# EAGLE design FT311_breakout.v1b (EAGLE 5.07)
LICENSE: CC-0; PROJECT: FT311 breakout v1b
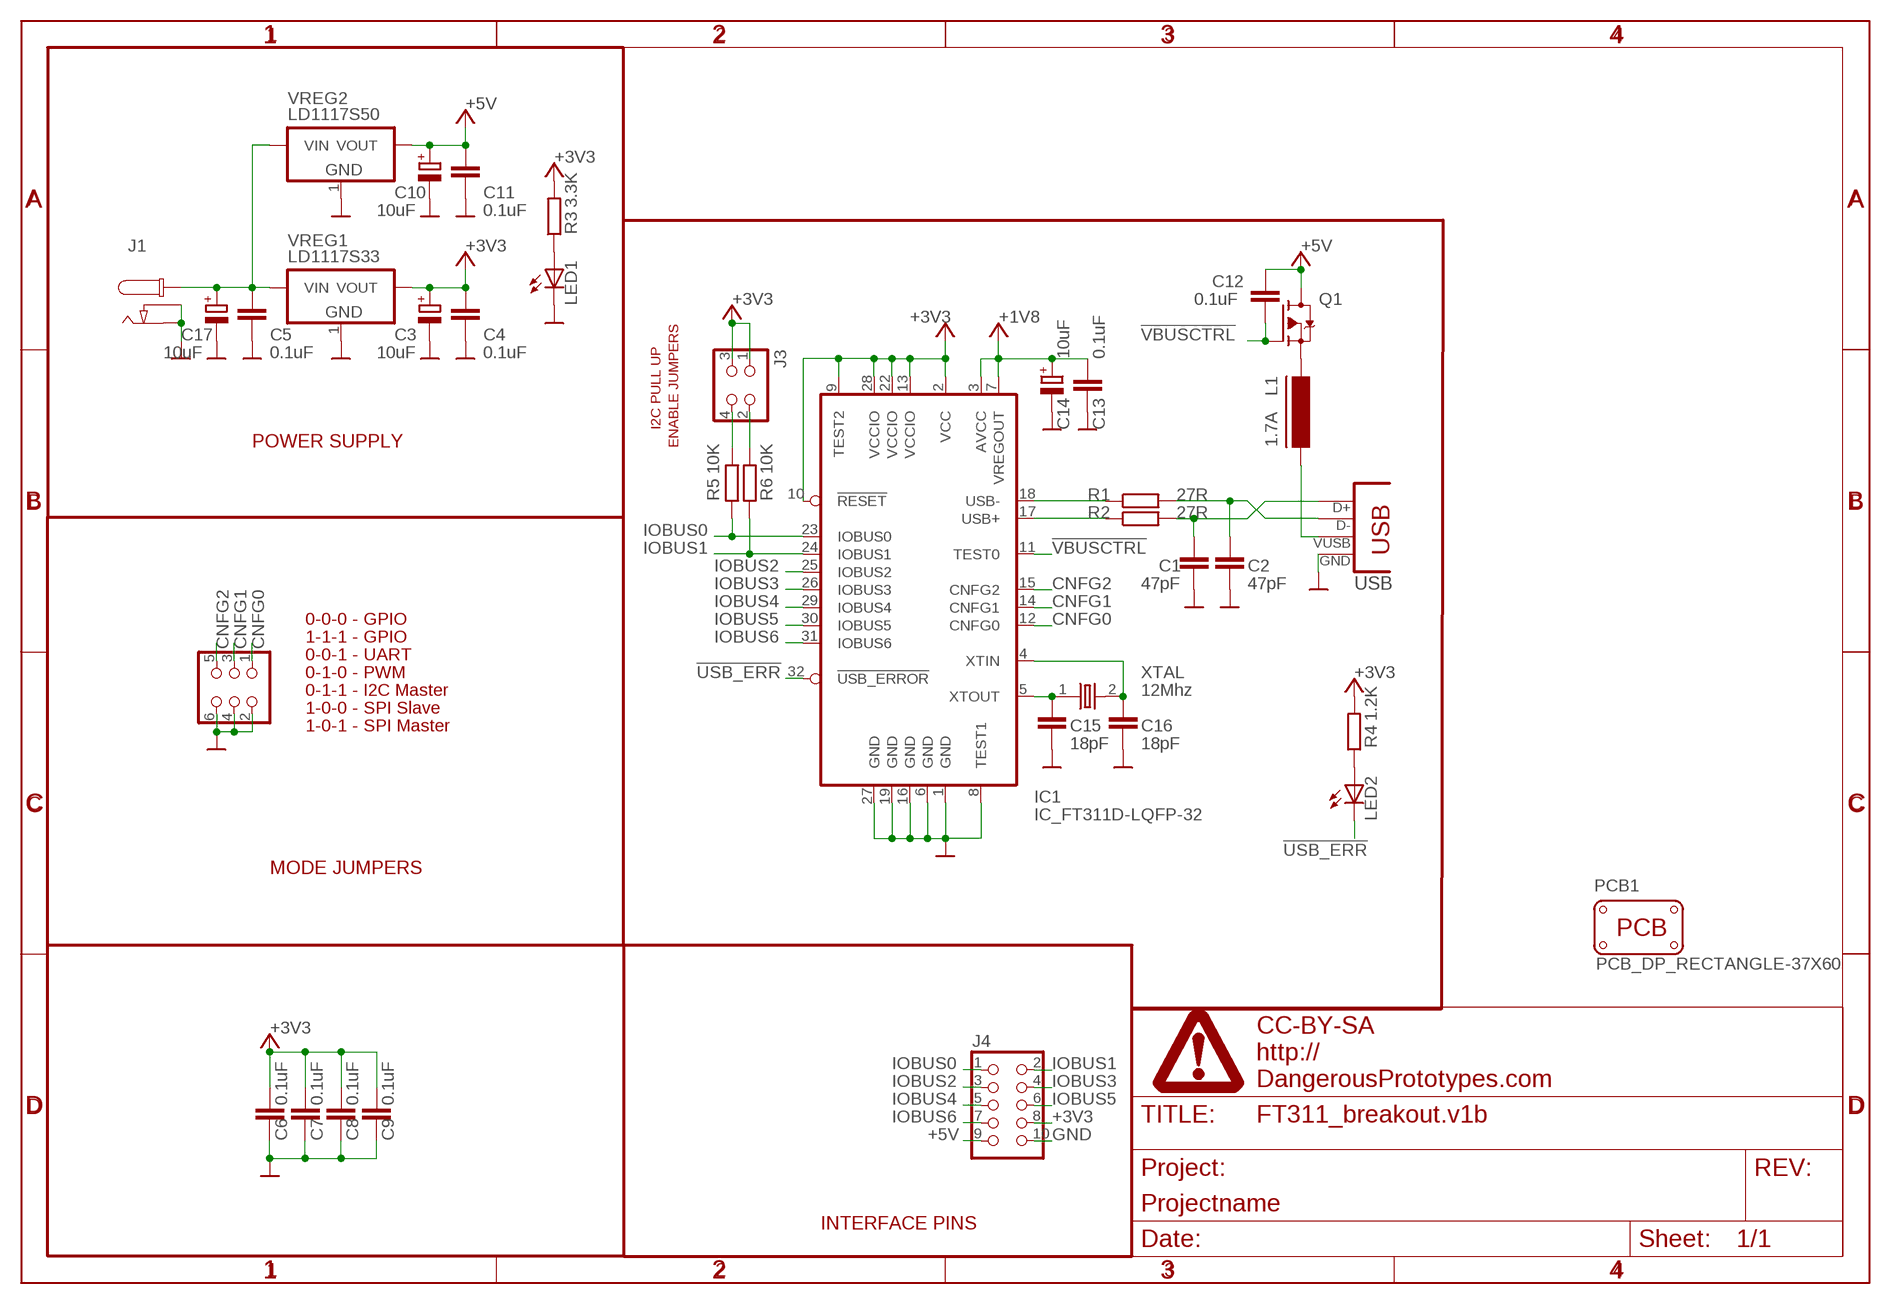
[diagram p0: schematic, sheet 1]

## Parts
C1  47pF  CAPACITOR_NPOL-0603  [C603]
C2  47pF  CAPACITOR_NPOL-0603  [C603]
C3  10uF  CAPACITOR_POL-SMC_A  [SMC_A]
C4  0.1uF  CAPACITOR_NPOL-0603  [C603]
C5  0.1uF  CAPACITOR_NPOL-0603  [C603]
C6  0.1uF  CAPACITOR_NPOL-0603  [C603]
C7  0.1uF  CAPACITOR_NPOL-0603  [C603]
C8  0.1uF  CAPACITOR_NPOL-0603  [C603]
C9  0.1uF  CAPACITOR_NPOL-0603  [C603]
C10  10uF  CAPACITOR_POL-SMC_A  [SMC_A]
C11  0.1uF  CAPACITOR_NPOL-0603  [C603]
C12  0.1uF  CAPACITOR_NPOL-0603  [C603]
C13  0.1uF  CAPACITOR_NPOL-0603  [C603]
C14  10uF  CAPACITOR_POL-SMC_A  [SMC_A]
C15  18pF  CAPACITOR_NPOL-0603  [C603]
C16  18pF  CAPACITOR_NPOL-0603  [C603]
C17  10uF  CAPACITOR_POL-SMC_A  [SMC_A]
IC1  IC_FT311D-LQFP-32  [LQFP-32]
J1  CON_DC_M-DC_SMD  [DC_BARREL_JACK_SMD_2MM]
J2  CON_HEADER_2X03-PTH  [M2X3]
J3  CON_HEADER_2X02-PTH  [M2X2]
J4  CON_HEADER_2X05-PTH  [M2X5]
L1  1.7A  FERRITE-0603  [FB603]
LED1  YELLOW  LED-0805  [LED-805]
LED2  RED  LED-0805  [LED-805]
PCB1  PCB_DP_RECTANGLE-37X60  [DP6037_V1]
Q1  TRANSISTOR_FET_TSM2301CX  [SOT-23]
R1  27R  RESISTOR-0603  [R603]
R2  27R  RESISTOR-0603  [R603]
R3  3.3K  RESISTOR-0603  [R603]
R4  1.2K  RESISTOR-0603  [R603]
R5  10K  RESISTOR-0603  [R603]
R6  10K  RESISTOR-0603  [R603]
U$1  FRAME_DINA4_L  [DP_LOGO]
USB  CON-USB-F-2PB  [CONN_USB_A_F]
VREG1  LD1117S33  VREG_3PINS-SOT-223  [SOT-223]
VREG2  LD1117S50  VREG_3PINS-SOT-223  [SOT-223]
XTAL  12Mhz  OSC-XTAL-HC-49U-SMD  [HC-49U]

## Nets
!USB_ERR: IC1.32(!USB_ERROR) LED2.C
!VBUSCTRL: C12.2 IC1.11(TEST0) Q1.1(G)
+1V8: C13.1 C14.+ IC1.3(AVCC) IC1.7(VREGOUT) ; supply symbol labelled SUPPLY_+3V3
+3V3: C3.+ C4.1 C6.1 C7.1 C8.1 C9.1 IC1.2(VCC) IC1.9(TEST2) IC1.10(!RESET) IC1.13(VCCIO) IC1.22(VCCIO) IC1.28(VCCIO) J3.1 J3.3 J4.8 R3.2 R4.2 VREG1.2(VOUT) ; supply symbol labelled SUPPLY_+3V3
+5V: C10.+ C11.1 C12.1 J4.9 Q1.3(D) VREG2.2(VOUT) ; supply symbol labelled SUPPLY_+5V
CNFG0: IC1.12(CNFG0) J2.1
CNFG1: IC1.14(CNFG1) J2.3
CNFG2: IC1.15(CNFG2) J2.5
GND: C1.2 C2.2 C3.- C4.2 C5.2 C6.2 C7.2 C8.2 C9.2 C10.- C11.2 C13.2 C14.- C15.2 C16.2 C17.- IC1.1(GND) IC1.6(GND) IC1.8(TEST1) IC1.16(GND) IC1.19(GND) IC1.27(GND) J1.P2 J1.P3 J2.2 J2.4 J2.6 J4.10 LED1.C USB.4(GND) VREG1.1(GND) VREG2.1(GND) ; supply symbol labelled SUPPLY_GND
IOBUS0: IC1.23(IOBUS0) J4.1 R5.1
IOBUS1: IC1.24(IOBUS1) J4.2 R6.1
IOBUS2: IC1.25(IOBUS2) J4.3
IOBUS3: IC1.26(IOBUS3) J4.4
IOBUS4: IC1.29(IOBUS4) J4.5
IOBUS5: IC1.30(IOBUS5) J4.6
IOBUS6: IC1.31(IOBUS6) J4.7
N$1: IC1.18(USB-) R1.1
N$2: IC1.17(USB+) R2.1
N$3: C1.1 R2.2 USB.3(D+)
N$4: C2.1 R1.2 USB.2(D-)
N$5: L1.2 USB.1(VUSB)
N$6: L1.1 Q1.2(S)
N$7: C16.1 IC1.4(XTIN) XTAL.2
N$8: C5.1 C17.+ J1.P1@2(P1) VREG1.3(VIN) VREG2.3(VIN)
N$9: C15.1 IC1.5(XTOUT) XTAL.1
N$10: LED1.A R3.1
N$11: LED2.A R4.1
N$12: J3.4 R5.2
N$13: J3.2 R6.2
Unconnected: USB.B1(BODY) USB.B2(BODY)

## Notes on the sheet
- I2C PULL UP
- POWER SUPPLY | ENABLE JUMPERS
- 0-0-0 - GPIO
- 1-1-1 - GPIO
- 0-0-1 - UART
- 0-1-0 - PWM
- 0-1-1 - I2C Master
- 1-0-0 - SPI Slave
- 1-0-1 - SPI Master
- MODE JUMPERS
- INTERFACE PINS

## Library data of the parts
C1 C2 C4-C9 C11-C13 C15 C16 = dp_devices:CAPACITOR_NPOL: Non-Polarized capacitor in various packages
C3 C10 C14 C17 = dp_devices:CAPACITOR_POL: Polarized capacitor in various packages
IC1 = dp_devices:IC_FT311D: USB Android Host Mfr no: FT311D-32L1C FT311D <http://www.ftdichip.com/Support/Documents/DataSheets/ICs/DS_FT311D.pdf>
J1 = dp_devices:CON_DC_M: DC power connector
J2 = dp_devices:CON_HEADER_2X03
J3 = dp_devices:CON_HEADER_2X02
J4 = dp_devices:CON_HEADER_2X05: 2x05 pin header
L1 = dp_devices:FERRITE: Ferrite bead in various packages
LED1 LED2 = dp_devices:LED: Light Emitting Diode
PCB1 = dp_devices:PCB_DP_RECTANGLE: Dangerous Prototypes Standard Rectangular PCB sizes
Q1 = dp_devices:TRANSISTOR_FET_TSM2301CX: 20V P-Channel Enhancement Mode MOSFET
R1-R6 = dp_devices:RESISTOR
U$1 = dp_devices:FRAME_DINA4_L: A4 DP frame Standard Dangerous Prototypes schematic frame. Automagically adds the DP logo and standard texts to the PCB Use the atrribute in the schematic editor to change the fields.; FF1: fulfillment by; FF2: Seeed Studio; FF3: www.seeedstudio.com; LICENSE: CC-BY-SA; PROJECT: Projectname; URL1: http://; URL2: DangerousPrototypes.com
USB = dp_devices:CON-USB-F-2PB: USB Female connector with 2 body pins
VREG1 VREG2 = dp_devices:VREG_3PINS: Various 3 pin voltage regulators in different packages Double check the right pinout for the right part
XTAL = dp_devices:OSC-XTAL

## Board
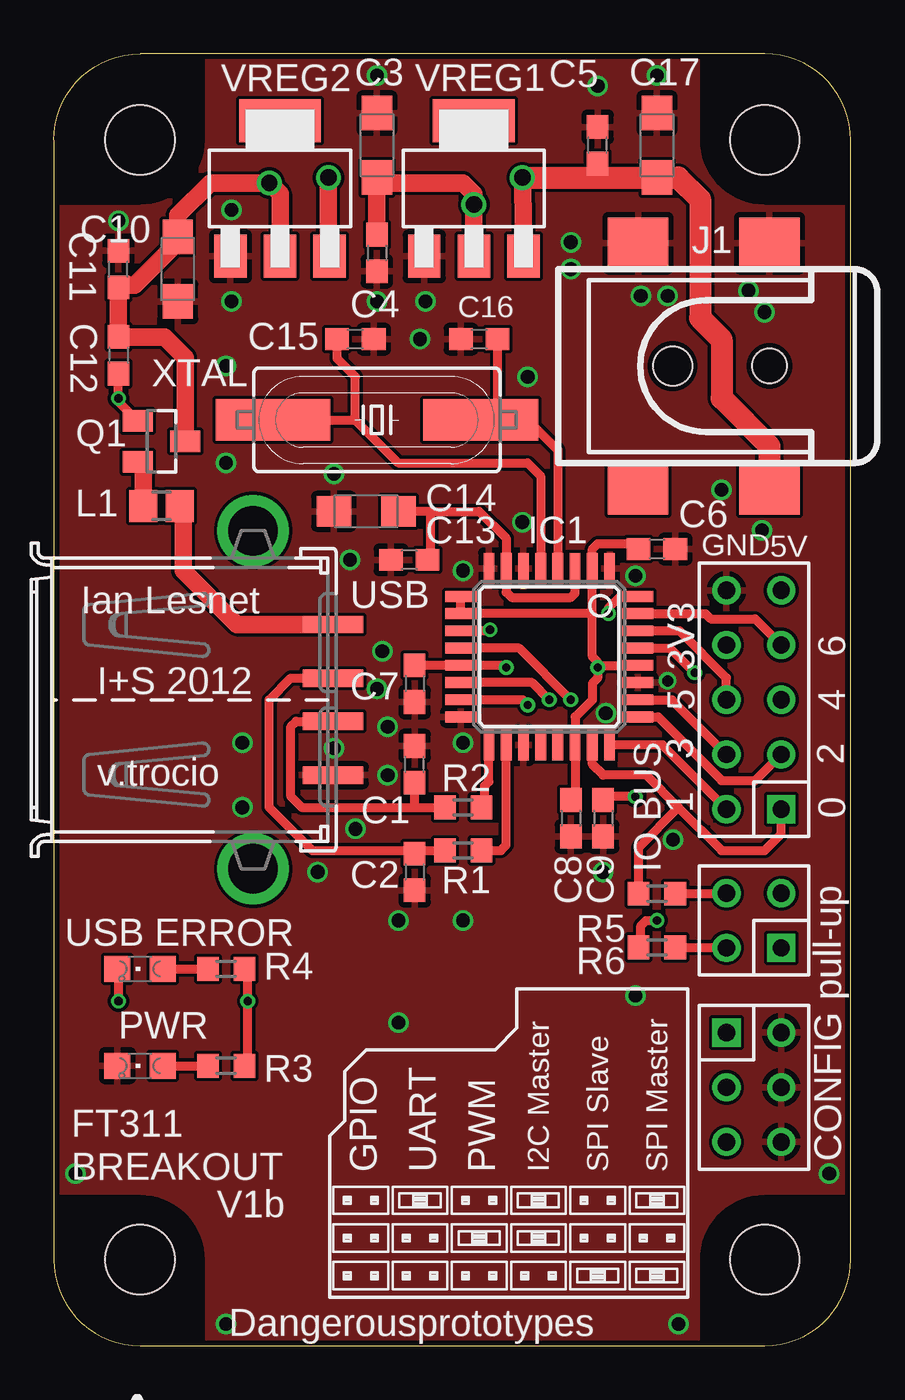
[diagram p1: board, top side]
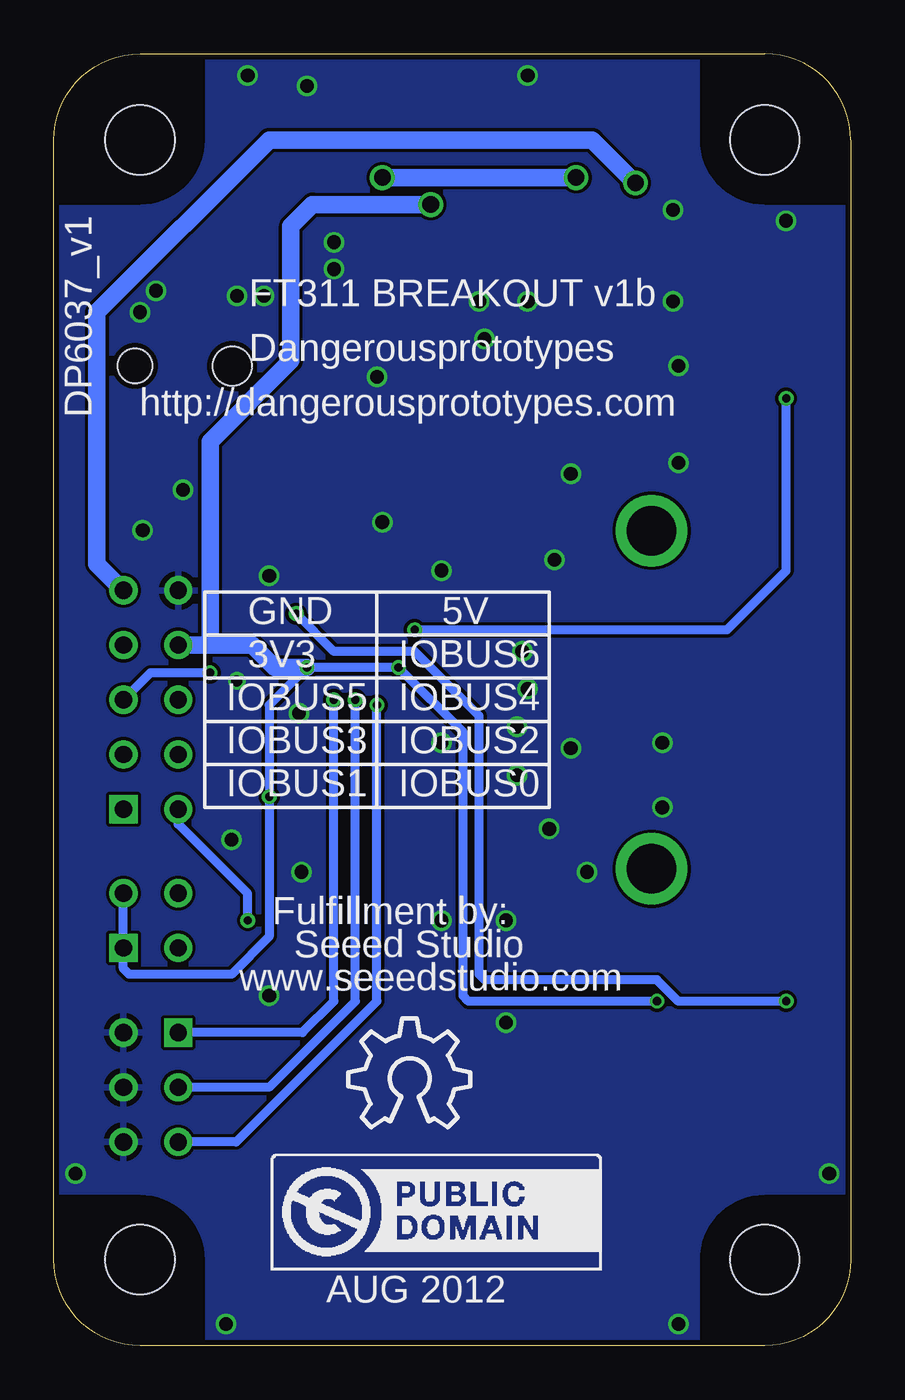
[diagram p2: board, bottom side, seen from below]

Size 37 x 60 mm. Coordinates in mm from the lower left corner, seen from the top.
Copper layers (1*16): Top 0.035mm / dielectric 1.5mm / Bottom 0.035mm
Design rules "Fusion_eagle_rule_v1.1": minimum track width 6mil, minimum drill 12mil, track to track 6mil, track to pad 6mil, pad to pad 6mil, via to via 6mil, smd to smd 0mil, copper to edge 10mil, drill to drill 10mil, minimum pad ring 10mil, minimum via ring 6mil, stop-mask expansion 2mil, vias tented up to drill 100mil, thermal gap 10mil

### Footprints (pad centres in the part's own frame; a part is rotated, then mirrored left to right if it is on the bottom)
C603 = smd 1.1 x 1: 1 -0.85,0; 2 0.85,0
SMC_A = smd 1.6 x 1.4: + -1.5,0; - 1.5,0
LQFP-32 = smd 0.5 x 1.45: 1 -2.8,-4.1; 2 -2,-4.1; 3 -1.2,-4.1; 4 -0.4,-4.1; 5 0.4,-4.1; 6 1.2,-4.1; 7 2,-4.1; 8 2.8,-4.1; 17 2.8,4.1; 18 2,4.1; 19 1.2,4.1; 20 0.4,4.1; 21 -0.4,4.1; 22 -1.2,4.1; 23 -2,4.1; 24 -2.8,4.1 | smd 1.45 x 0.5: 9 4.1,-2.8; 10 4.1,-2; 11 4.1,-1.2; 12 4.1,-0.4; 13 4.1,0.4; 14 4.1,1.2; 15 4.1,2; 16 4.1,2.8; 25 -4.1,2.8; 26 -4.1,2; 27 -4.1,1.2; 28 -4.1,0.4; 29 -4.1,-0.4; 30 -4.1,-1.2; 31 -4.1,-2; 32 -4.1,-2.8
DC_BARREL_JACK_SMD_2MM = smd 2.4 x 2.8: P1@1 -5.7,3.875; P1@2 -5.7,-2.225; P2 5.7,-2.225; P3 5.7,3.875 | hole 1.8: 0,2.275 | hole 1.6: 0,-2.225
M2X3 = drill 0.8 square: 1 -2.54,-1.27 | drill 0.8 round: 2 -2.54,1.27; 3 0,-1.27; 4 0,1.27; 5 2.54,-1.27; 6 2.54,1.27
M2X2 = drill 0.8 square: 1 -1.27,-1.27 | drill 0.8 round: 2 -1.27,1.27; 3 1.27,-1.27; 4 1.27,1.27
M2X5 = drill 0.8 square: 1 -5.08,-1.27 | drill 0.8 round: 2 -5.08,1.27; 3 -2.54,-1.27; 4 -2.54,1.27; 5 0,-1.27; 6 0,1.27; 7 2.54,-1.27; 8 2.54,1.27; 9 5.08,-1.27; 10 5.08,1.27
FB603 = smd 1.3 x 1.5: 1 -0.85,0; 2 0.85,0
LED-805 = smd 1.2 x 1.2: A 0,-1.05; C 0,1.05
DP6037_V1 = hole 3.2: 4,4; 56,4; 56,33; 4,33
SOT-23 = smd 1 x 1.4: 1 -0.95,-1.1; 2 0.95,-1.1; 3 0,1.1
R603 = smd 1 x 1.1: 1 -0.85,0; 2 0.85,0
CONN_USB_A_F = smd 0.8 x 2.82: 1 -3.5,6.46; 2 -1,6.46; 3 1,6.46; 4 3.5,6.46 | drill 2.3 round: B1 -7.85,2.75; B2 7.85,2.75
SOT-223 = smd 1.5 x 2: 1 -2.3,-3.15; 2 0,-3.15; 3 2.3,-3.15 | smd 3.8 x 2: 4 0,3.15
HC-49U = smd 5.334 x 1.93: 1 -4.826,0; 2 4.826,0

### Placement (x,y rotation side)
C1  16.75,27 90 top
C2  16.75,22 270 top
C3  15,55.75 90 top
C4  15,50.75 270 top
C5  25.25,55.75 90 top
C6  28,37 0 top
C7  16.75,30.75 270 top
C8  24,24.5 270 top
C9  25.5,24.5 270 top
C10  5.75,50 270 top
C11  3,50 90 top
C12  3,46 270 top
C13  16.5,36.5 180 top
C14  14.5,38.75 180 top
C15  14,46.75 0 top
C16  19.75,46.75 180 top
C17  28,55.75 90 top
IC1  23,32 180 top
J1  31,45.5 90 top
J2  32.5,12 270 top
J3  32.5,19.75 90 top
J4  32.5,30 90 top
L1  5,39 0 top
LED1  4,13 90 top
LED2  4,17.5 90 top
PCB1  37,0 90 top
Q1  5,42 270 top
R1  19,23 180 top
R2  19,25 180 top
R3  8,13 0 top
R4  8,17.5 0 top
R5  28,21 0 top
R6  28,18.5 0 top
U$1  3.87,-4.9 0 top  (outside the outline)
U$2  [JUMP2_DESC_OFF]  14.25,6.75 0 top
U$3  [JUMP2_DESC_ON]  19.75,5 180 top
U$4  [JUMP2_DESC_OFF]  14.25,5 0 top
U$5  [JUMP2_DESC_ON]  17,6.75 180 top
U$6  [JUMP2_DESC_ON]  22.5,5 180 top
U$7  [JUMP2_DESC_ON]  25.25,3.25 180 top
U$8  [JUMP2_DESC_ON]  28,6.75 180 top
U$9  [JUMP2_DESC_ON]  22.5,6.75 180 top
U$10  [JUMP2_DESC_OFF]  14.25,3.25 0 top
U$11  [JUMP2_DESC_OFF]  17,5 0 top
U$12  [JUMP2_DESC_OFF]  17,3.25 0 top
U$13  [JUMP2_DESC_OFF]  19.75,6.75 0 top
U$14  [JUMP2_DESC_OFF]  19.75,3.25 0 top
U$15  [JUMP2_DESC_OFF]  22.5,3.25 0 top
U$16  [JUMP2_DESC_OFF]  25.25,5 0 top
U$17  [JUMP2_DESC_OFF]  25.25,6.75 0 top
U$18  [JUMP2_DESC_ON]  28,3.25 180 top
U$19  [JUMP2_DESC_OFF]  28,5 0 top
U$20  [LOGO_CC-0]  26.9,3.53 0 bottom
U$21  [OSHW_8X200_NOTEXT]  23.32,10.13 0 bottom
U$22  [JUMP2_DESC_ON]  43,19 180 top  (outside the outline)
U$23  [JUMP2_DESC_OFF]  46,17 0 top  (outside the outline)
U$24  [JUMP2_DESC_ON]  43,17 180 top  (outside the outline)
U$25  [JUMP2_DESC_OFF]  46,19 0 top  (outside the outline)
USB  6.5,30 270 top
VREG1  19.5,53.75 0 top
VREG2  10.5,53.75 0 top
XTAL  15,43 0 top

### Tracks (layer width: path | path; a pad name or v marks a point on that pad's centre or on a via)
!USB_ERR  (via drill 0.38)
  Top 0.406: LED2.C 3,17.5 v3,16 | v25.75,34 25.75,34.25 26.3,34.8 IC1.32
  Bottom 0.406: v3,16 8,16 9,17 17,17 17.25,17.25 17.25,29.25 20.25,32.25 24,32.25 v25.75,34
!VBUSCTRL  (via drill 0.38)
  Top 0.406: C12.2 v3,44 3,43.85 Q1.1 | IC1.11 20.2,33.2 v20.25,33.25
  Bottom 0.406: v20.25,33.25 5.75,33.25 3,36 v3,44
+1V8
  Top 0.406: IC1.3 24.2,34.95 24,34.75 21.25,34.75 21,35 IC1.7 21,37.5 19.75,38.75 17.5,38.75 | C13.1 17.5,36.5 17.5,38.75 | 17.5,38.75 C14.+
+3V3  (via drill 0.38, 0.77)
  Top 0.406: C7.1 IC1.13 20.9,31.6 v21,31.5 | 25,34 25,32 25.25,31.75 v25.25,31.5 | 25,34 IC1.2 25,37 25.25,37.25 26.9,37.25 C6.1 | v25.25,31.5 25.25,31 25,30.75 25,30 24.2,29.2 IC1.22 24.2,25.55 C8.1 | IC1.28 25.35,31.6 v25.25,31.5 | 25,34 IC1.10 IC1.9 | R3.2 9,13 v9,16 9,17.35 R4.2 | C9.1 25.5,25.5 v27,25.5
  Top 0.813: C3.+ C4.1 | C3.+ 15,54.5 | v19.5,53 VREG1.2 19.5,53.5 19,54 15.25,54 C3.+
  Bottom 0.406: v9,16 17.75,16 18,16.25 18,28.5 v21,31.5 v25.25,31.5 27,29.75 v27,25.5 27,19 28.75,17.25 33.5,17.25 33.77,17.52 J3.1 J3.3
  Bottom 0.813: v19.5,53 25,53 26,52 26,45.75 29.75,42 29.75,32.54 | v25.25,31.5 26.75,31.5 27.79,32.54 29.75,32.54 | 29.75,32.54 J4.8
+5V  (via drill 0.76)
  Top 0.813: Q1.3 6.1,45.9 5.15,46.85 C12.1 C11.1 3.1,49.25 3.75,49.25 5.5,51 C10.+ 5.75,52.5 7.25,54 v10,54 10.5,53.5 VREG2.2
  Bottom 0.813: v10,54 12,56 27,56 35,48 35,36.31 J4.9
CNFG0  (via drill 0.38)
  Top 0.406: IC1.12 21.6,32.4 v24,30
  Bottom 0.406: v24,30 24,16 25.46,14.54 J2.1
CNFG1  (via drill 0.38)
  Top 0.406: IC1.14 22.2,30.8 v23,30
  Bottom 0.406: v23,30 23,16 27,12 J2.3
CNFG2  (via drill 0.38)
  Top 0.406: IC1.15 21.75,30 v22,29.75
  Bottom 0.406: v22,29.75 22,16 28.54,9.46 J2.5
GND  (via drill 0.51, 0.64)
  other vias: 17,46.75 32.88,37.88 32.25,49 27.25,48.75 24,51.25 17.25,48.5 15,48.5 8.25,48.5 3,52.25 8.25,52.75 25.25,58.5 28,59 15,59 15.5,26.5 15.25,32.25 13,27.75 13.75,36.5 19,36 21.75,38.25 27,35.75 28.5,30.88 19,28 25.5,22 27,16.25 16,15 15.5,28.75 15,30.5 25.62,29.38 31,39.75 16,19.75 24,50 28.5,48.75 33,48 28.75,23.5 13,40.5 8,41 8,45.5 22,45 19,19.75 8,1 1,8 29,1 36,8 14,24 8.75,28 8.75,25 12.25,22
  pour Top: 37,0 0,0 0,60 37,60
  pour Bottom: 37,0 0,0 0,60 37,60
IOBUS0
  Top 0.406: IC1.23 25,27 25.5,26.5 27.5,26.5 29,25 | J4.1 33.77,23.77 33,23 31,23 29,25 | R5.1 27.15,23.15 29,25
IOBUS1  (via drill 0.38)
  Top 0.406: IC1.24 28.25,27.9 J4.2 | v28,19.75 27.5,19.75 27.25,19.5 27.25,18.6 R6.1
  Bottom 0.406: v28,19.75 28,21 31.23,24.23 J4.2
IOBUS2
  Top 0.406: IC1.25 28.05,29.2 31,26.25 32.56,26.25 J4.3
IOBUS3
  Top 0.406: IC1.26 28.69,30 J4.4
IOBUS4  (via drill 0.38)
  Top 0.406: IC1.29 28.6,32.4 v29.75,31.25
  Bottom 0.406: v29.75,31.25 32.52,31.25 J4.5
IOBUS5
  Top 0.406: IC1.30 29.05,33.2 31.23,31.02 J4.6
IOBUS6
  Top 0.406: IC1.31 30.25,34 30.5,33.75 32.56,33.75 J4.7
N$1
  Top 0.406: IC1.18 21,23.25 20.75,23 R1.1
N$2
  Top 0.406: IC1.17 20.2,26.2 20,26 20,25.15 R2.1
N$3
  Top 0.406: USB.3 11.25,29 11,28.75 11,25.5 11.5,25 16.75,25 | 16.75,25 R2.2 | 16.75,25 C1.1
N$4
  Top 0.406: USB.2 11,31 10,30 10,25 12,23 16.75,23 C2.1 16.9,23 R1.2
N$5
  Top 0.813: USB.1 8.5,33.5 6,36 6,38.85 L1.2
N$6
  Top 0.813: L1.1 4.15,40.8 Q1.2
N$7
  Top 0.406: XTAL.2 21,43 | 21,43 22,43 23.4,41.6 IC1.4 | C16.1 20.6,43.4 21,43
N$8  (via drill 0.76)
  Top 0.813: v12.75,54.25 12.75,50.65 VREG2.3 | VREG1.3 21.8,52.7 v21.75,54.25 | C5.1 25.25,54.5 25,54.25
  Top 1.016: J1.P1@2 33.23,41.77 31,44 31,46.73 30,47.73 30,53.25 29,54.25 C17.+ 25,54.25 v21.75,54.25
  Bottom 0.813: v12.75,54.25 v21.75,54.25
N$9
  Top 0.406: IC1.5 22.6,40.4 22,41 16,41 14,43 | XTAL.1 14,43 | C15.1 13.15,45.85 14,45 14,43
N$10
  Top 0.406: LED1.A R3.1
N$11
  Top 0.406: LED2.A R4.1
N$12
  Top 0.406: R5.2 31.21,21 J3.4
N$13
  Top 0.406: R6.2 31.21,18.5 J3.2

### Text on the board
tPlace: GND | 5V | Ian Lesnet | 6 | 3V3 | I+S 2012 | 5 | 4 | 3 | 2 | v.trocio | 1 | 0 | IO BUS | USB ERROR | pull-up | PWR | FT311 | CONFIG | BREAKOUT | GPIO | UART | PWM | I2C Master | SPI Slave | SPI Master | V1b | Dangerousprototypes
bPlace: FT311 BREAKOUT v1b | Dangerousprototypes | http://dangerousprototypes.com | 5V | GND | IOBUS6 | 3V3 | IOBUS4 | IOBUS5 | IOBUS2 | IOBUS3 | IOBUS0 | IOBUS1 | Fulfillment by: | Seeed Studio | www.seeedstudio.com | AUG 2012
Document: GND | 5V | 3V3 | IOBUS6 | IOBUS5 | IOBUS4 | IOBUS3 | IOBUS2 | IOBUS1 | IOBUS0 | ON | OFF | I2C | pull-up